# EAGLE design aiie (EAGLE 9.6.2)
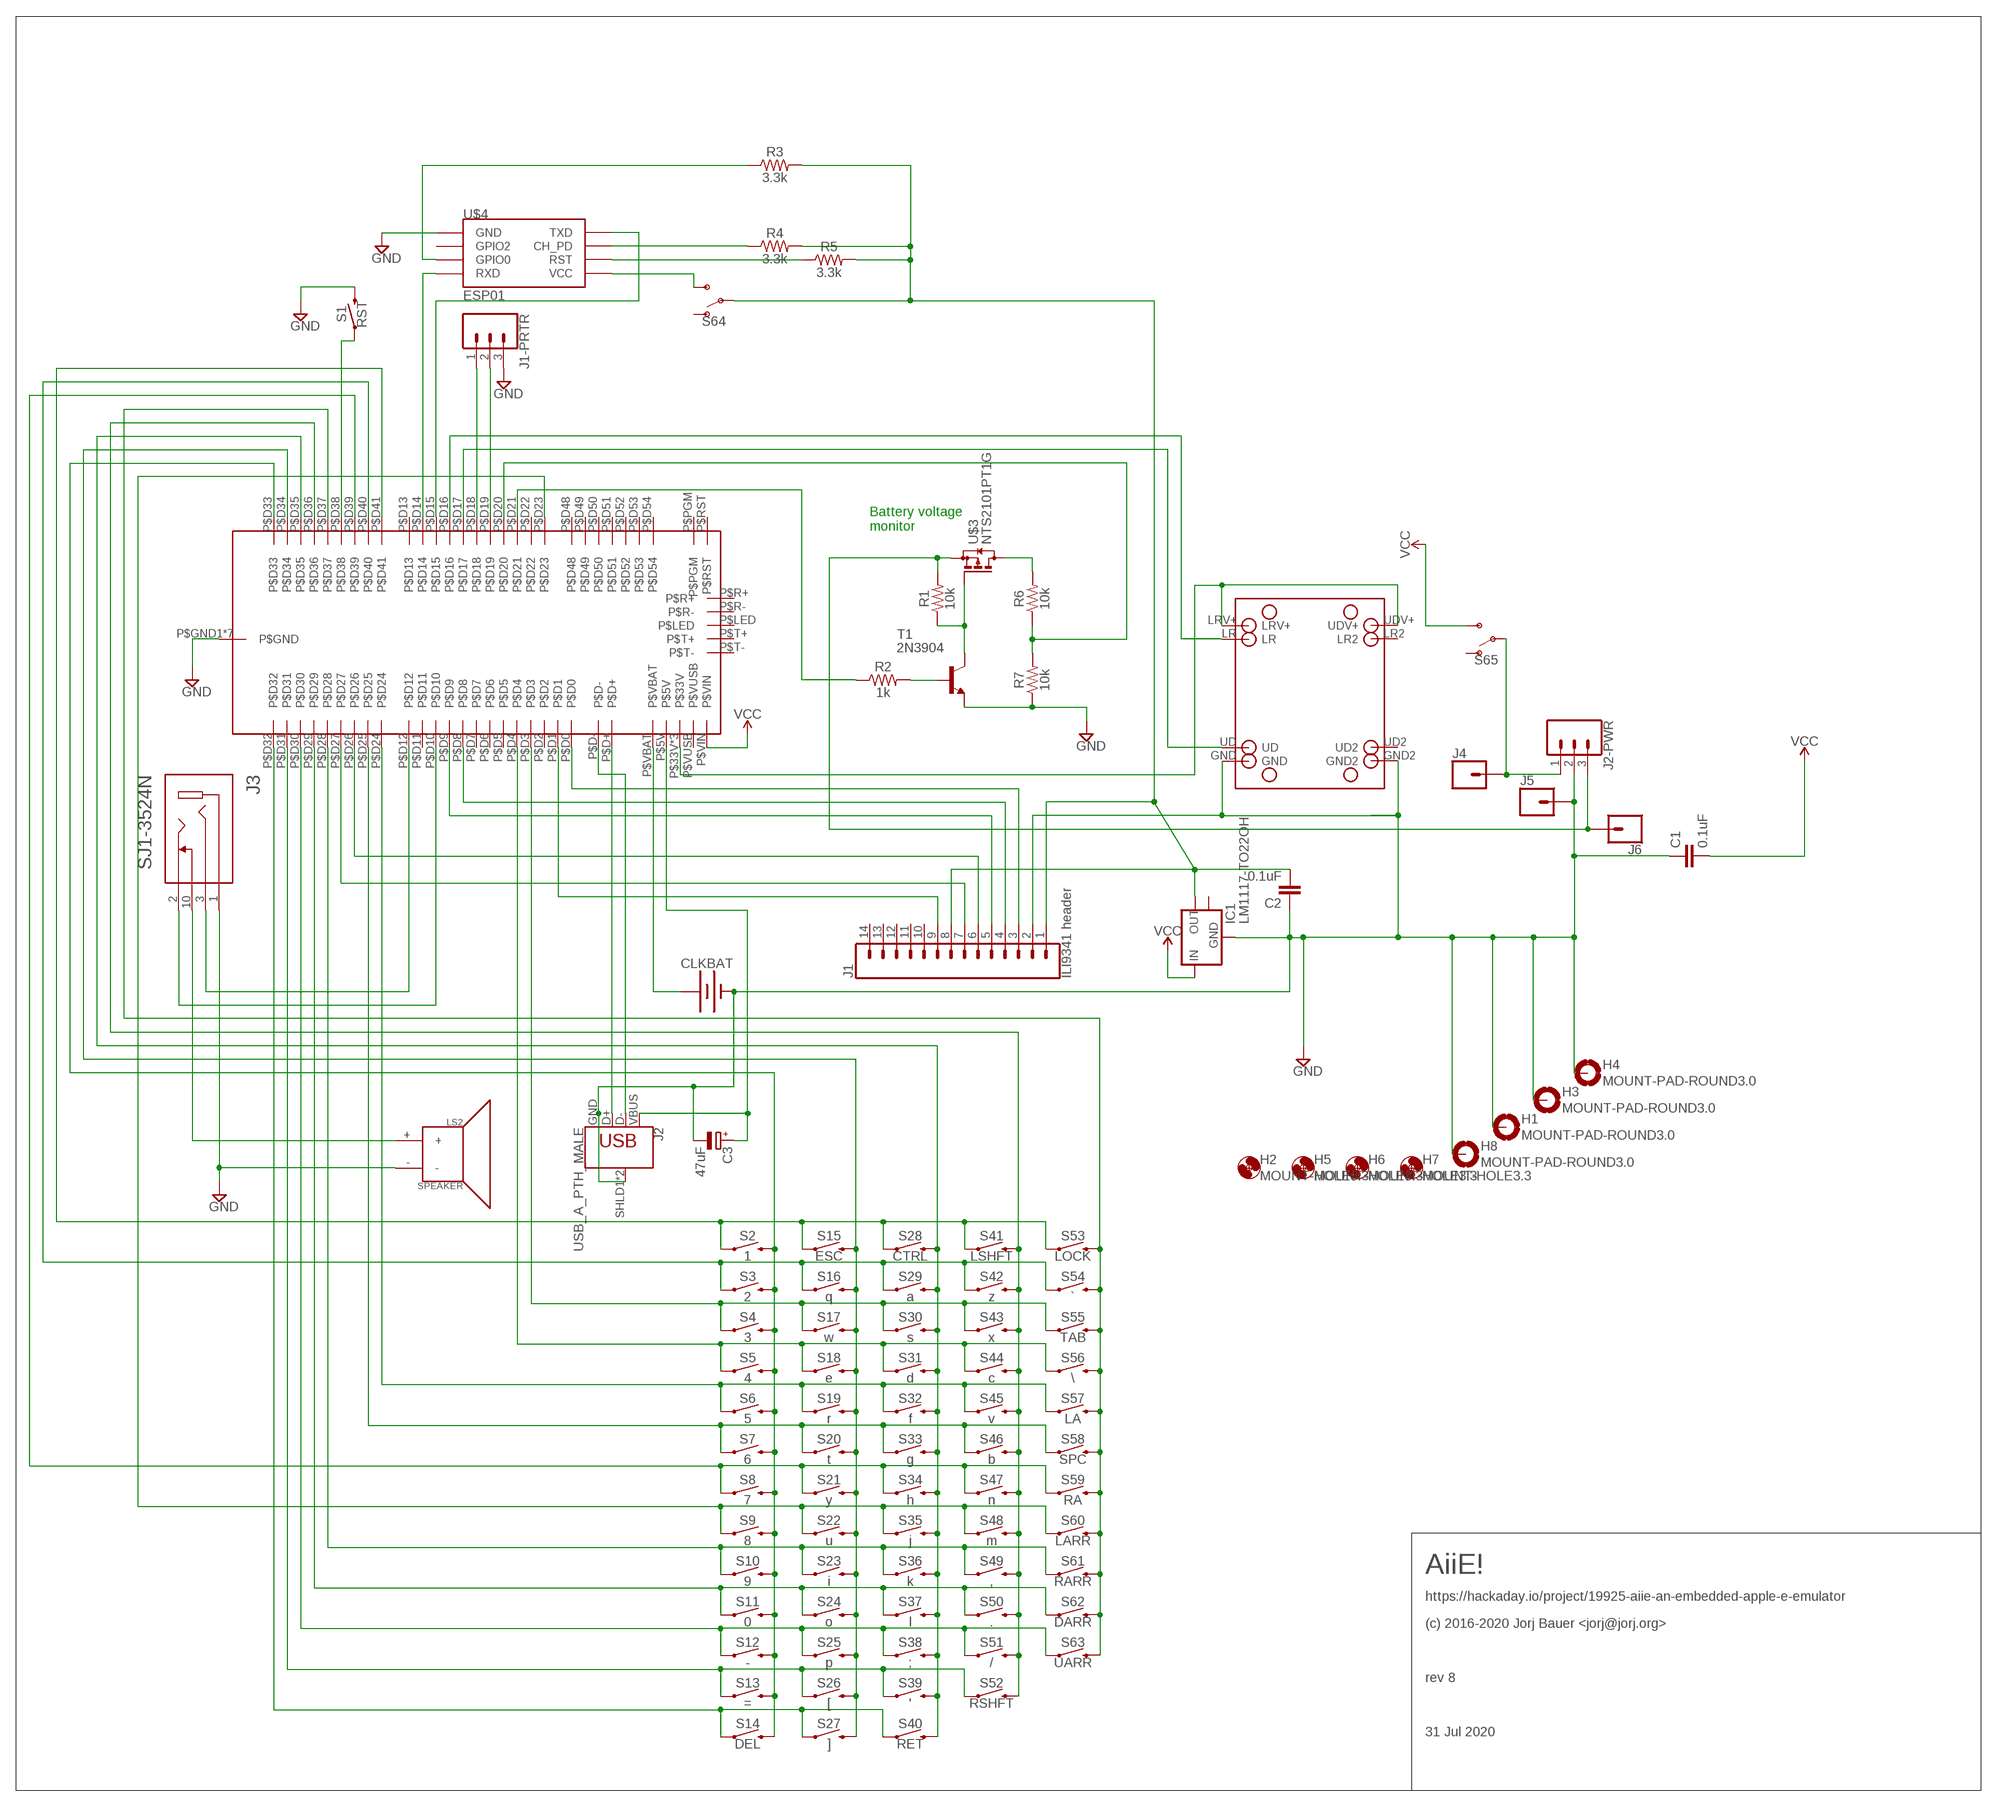
[diagram p0: schematic, sheet 1]

## Parts
C1  0.1uF  C-EU025_050-025X075  [C025_050-025X075]
C2  0.1uF  C-EU025_050-025X075  [C025_050-025X075]
C3  47uF  C-POL_RADIAL-11MM-DIA  [CAPPRD508W65D1000H1100B]
CLKBAT  BATTERY-20MM_PTH  [BATTCOM_20MM_PTH]
H1  MOUNT-PAD-ROUND3.0  [3,0-PAD]
H2  MOUNT-HOLE3.3  [3,3]
H3  MOUNT-PAD-ROUND3.0  [3,0-PAD]
H4  MOUNT-PAD-ROUND3.0  [3,0-PAD]
H5  MOUNT-HOLE3.3  [3,3]
H6  MOUNT-HOLE3.3  [3,3]
H7  MOUNT-HOLE3.3  [3,3]
H8  MOUNT-PAD-ROUND3.0  [3,0-PAD]
IC1  LM1117-TO22OH  [TO220L1]
J1  ILI9341 header  CONN_14  [1X14]
J1-PRTR  CONN_03  [1X03]
J2  USB_A_PTH_MALE  [USB-A-H]
J2-PWR  CONN_03  [1X03]
J3  SJ1-3524N  [CUI_SJ1-3524N]
J4  CONN_01  [1X01]
J5  CONN_01  [1X01]
J6  CONN_01  [1X01]
LS2  SPEAKER  [PCB_MOUNT_SPEAKER]
R1  10k  1KOHM-HORIZ-1/4W-1%  [AXIAL-0.3]
R2  1k  1KOHM-HORIZ-1/4W-1%  [AXIAL-0.3]
R3  3.3k  1KOHM-HORIZ-1/4W-1%  [AXIAL-0.3]
R4  3.3k  1KOHM-HORIZ-1/4W-1%  [AXIAL-0.3]
R5  3.3k  1KOHM-HORIZ-1/4W-1%  [AXIAL-0.3]
R6  10k  1KOHM-HORIZ-1/4W-1%  [AXIAL-0.3]
R7  10k  1KOHM-HORIZ-1/4W-1%  [AXIAL-0.3]
S1  RST  MOMENTARY-SWITCH-SPST-PTH-6.0MM  [TACTILE_SWITCH_PTH_6.0MM]
S2  1  MOMENTARY-SWITCH-SPST-PTH-6.0MM  [TACTILE_SWITCH_PTH_6.0MM]
S3  2  MOMENTARY-SWITCH-SPST-PTH-6.0MM  [TACTILE_SWITCH_PTH_6.0MM]
S4  3  MOMENTARY-SWITCH-SPST-PTH-6.0MM  [TACTILE_SWITCH_PTH_6.0MM]
S5  4  MOMENTARY-SWITCH-SPST-PTH-6.0MM  [TACTILE_SWITCH_PTH_6.0MM]
S6  5  MOMENTARY-SWITCH-SPST-PTH-6.0MM  [TACTILE_SWITCH_PTH_6.0MM]
S7  6  MOMENTARY-SWITCH-SPST-PTH-6.0MM  [TACTILE_SWITCH_PTH_6.0MM]
S8  7  MOMENTARY-SWITCH-SPST-PTH-6.0MM  [TACTILE_SWITCH_PTH_6.0MM]
S9  8  MOMENTARY-SWITCH-SPST-PTH-6.0MM  [TACTILE_SWITCH_PTH_6.0MM]
S10  9  MOMENTARY-SWITCH-SPST-PTH-6.0MM  [TACTILE_SWITCH_PTH_6.0MM]
S11  0  MOMENTARY-SWITCH-SPST-PTH-6.0MM  [TACTILE_SWITCH_PTH_6.0MM]
S12  -  MOMENTARY-SWITCH-SPST-PTH-6.0MM  [TACTILE_SWITCH_PTH_6.0MM]
S13  =  MOMENTARY-SWITCH-SPST-PTH-6.0MM  [TACTILE_SWITCH_PTH_6.0MM]
S14  DEL  MOMENTARY-SWITCH-SPST-PTH-6.0MM  [TACTILE_SWITCH_PTH_6.0MM]
S15  ESC  MOMENTARY-SWITCH-SPST-PTH-6.0MM  [TACTILE_SWITCH_PTH_6.0MM]
S16  q  MOMENTARY-SWITCH-SPST-PTH-6.0MM  [TACTILE_SWITCH_PTH_6.0MM]
S17  w  MOMENTARY-SWITCH-SPST-PTH-6.0MM  [TACTILE_SWITCH_PTH_6.0MM]
S18  e  MOMENTARY-SWITCH-SPST-PTH-6.0MM  [TACTILE_SWITCH_PTH_6.0MM]
S19  r  MOMENTARY-SWITCH-SPST-PTH-6.0MM  [TACTILE_SWITCH_PTH_6.0MM]
S20  t  MOMENTARY-SWITCH-SPST-PTH-6.0MM  [TACTILE_SWITCH_PTH_6.0MM]
S21  y  MOMENTARY-SWITCH-SPST-PTH-6.0MM  [TACTILE_SWITCH_PTH_6.0MM]
S22  u  MOMENTARY-SWITCH-SPST-PTH-6.0MM  [TACTILE_SWITCH_PTH_6.0MM]
S23  i  MOMENTARY-SWITCH-SPST-PTH-6.0MM  [TACTILE_SWITCH_PTH_6.0MM]
S24  o  MOMENTARY-SWITCH-SPST-PTH-6.0MM  [TACTILE_SWITCH_PTH_6.0MM]
S25  p  MOMENTARY-SWITCH-SPST-PTH-6.0MM  [TACTILE_SWITCH_PTH_6.0MM]
S26  [  MOMENTARY-SWITCH-SPST-PTH-6.0MM  [TACTILE_SWITCH_PTH_6.0MM]
S27  ]  MOMENTARY-SWITCH-SPST-PTH-6.0MM  [TACTILE_SWITCH_PTH_6.0MM]
S28  CTRL  MOMENTARY-SWITCH-SPST-PTH-6.0MM  [TACTILE_SWITCH_PTH_6.0MM]
S29  a  MOMENTARY-SWITCH-SPST-PTH-6.0MM  [TACTILE_SWITCH_PTH_6.0MM]
S30  s  MOMENTARY-SWITCH-SPST-PTH-6.0MM  [TACTILE_SWITCH_PTH_6.0MM]
S31  d  MOMENTARY-SWITCH-SPST-PTH-6.0MM  [TACTILE_SWITCH_PTH_6.0MM]
S32  f  MOMENTARY-SWITCH-SPST-PTH-6.0MM  [TACTILE_SWITCH_PTH_6.0MM]
S33  g  MOMENTARY-SWITCH-SPST-PTH-6.0MM  [TACTILE_SWITCH_PTH_6.0MM]
S34  h  MOMENTARY-SWITCH-SPST-PTH-6.0MM  [TACTILE_SWITCH_PTH_6.0MM]
S35  j  MOMENTARY-SWITCH-SPST-PTH-6.0MM  [TACTILE_SWITCH_PTH_6.0MM]
S36  k  MOMENTARY-SWITCH-SPST-PTH-6.0MM  [TACTILE_SWITCH_PTH_6.0MM]
S37  l  MOMENTARY-SWITCH-SPST-PTH-6.0MM  [TACTILE_SWITCH_PTH_6.0MM]
S38  ;  MOMENTARY-SWITCH-SPST-PTH-6.0MM  [TACTILE_SWITCH_PTH_6.0MM]
S39  '  MOMENTARY-SWITCH-SPST-PTH-6.0MM  [TACTILE_SWITCH_PTH_6.0MM]
S40  RET  MOMENTARY-SWITCH-SPST-PTH-6.0MM  [TACTILE_SWITCH_PTH_6.0MM]
S41  LSHFT  MOMENTARY-SWITCH-SPST-PTH-6.0MM  [TACTILE_SWITCH_PTH_6.0MM]
S42  z  MOMENTARY-SWITCH-SPST-PTH-6.0MM  [TACTILE_SWITCH_PTH_6.0MM]
S43  x  MOMENTARY-SWITCH-SPST-PTH-6.0MM  [TACTILE_SWITCH_PTH_6.0MM]
S44  c  MOMENTARY-SWITCH-SPST-PTH-6.0MM  [TACTILE_SWITCH_PTH_6.0MM]
S45  v  MOMENTARY-SWITCH-SPST-PTH-6.0MM  [TACTILE_SWITCH_PTH_6.0MM]
S46  b  MOMENTARY-SWITCH-SPST-PTH-6.0MM  [TACTILE_SWITCH_PTH_6.0MM]
S47  n  MOMENTARY-SWITCH-SPST-PTH-6.0MM  [TACTILE_SWITCH_PTH_6.0MM]
S48  m  MOMENTARY-SWITCH-SPST-PTH-6.0MM  [TACTILE_SWITCH_PTH_6.0MM]
S49  ,  MOMENTARY-SWITCH-SPST-PTH-6.0MM  [TACTILE_SWITCH_PTH_6.0MM]
S50  .  MOMENTARY-SWITCH-SPST-PTH-6.0MM  [TACTILE_SWITCH_PTH_6.0MM]
S51  /  MOMENTARY-SWITCH-SPST-PTH-6.0MM  [TACTILE_SWITCH_PTH_6.0MM]
S52  RSHFT  MOMENTARY-SWITCH-SPST-PTH-6.0MM  [TACTILE_SWITCH_PTH_6.0MM]
S53  LOCK  MOMENTARY-SWITCH-SPST-PTH-6.0MM  [TACTILE_SWITCH_PTH_6.0MM]
S54  `  MOMENTARY-SWITCH-SPST-PTH-6.0MM  [TACTILE_SWITCH_PTH_6.0MM]
S55  TAB  MOMENTARY-SWITCH-SPST-PTH-6.0MM  [TACTILE_SWITCH_PTH_6.0MM]
S56  \\  MOMENTARY-SWITCH-SPST-PTH-6.0MM  [TACTILE_SWITCH_PTH_6.0MM]
S57  LA  MOMENTARY-SWITCH-SPST-PTH-6.0MM  [TACTILE_SWITCH_PTH_6.0MM]
S58  SPC  MOMENTARY-SWITCH-SPST-PTH-6.0MM  [TACTILE_SWITCH_PTH_6.0MM]
S59  RA  MOMENTARY-SWITCH-SPST-PTH-6.0MM  [TACTILE_SWITCH_PTH_6.0MM]
S60  LARR  MOMENTARY-SWITCH-SPST-PTH-6.0MM  [TACTILE_SWITCH_PTH_6.0MM]
S61  RARR  MOMENTARY-SWITCH-SPST-PTH-6.0MM  [TACTILE_SWITCH_PTH_6.0MM]
S62  DARR  MOMENTARY-SWITCH-SPST-PTH-6.0MM  [TACTILE_SWITCH_PTH_6.0MM]
S63  UARR  MOMENTARY-SWITCH-SPST-PTH-6.0MM  [TACTILE_SWITCH_PTH_6.0MM]
S64  SWITCH-SPDT-PTH-11.6X4.0MM  [SWITCH_SPDT_PTH_11.6X4.0MM]
S65  SWITCH-SPDT-PTH-11.6X4.0MM  [SWITCH_SPDT_PTH_11.6X4.0MM]
T1  2N3904  [TO92]
U$1  PARALLAX2AXIS  [PARALLAX2AXIS]
U$2  TEENSY41  [TEENSY41]
U$3  NTS2101PT1G  [SOT323]
U$4  ESP01  [ESP01]

## Nets
GND [ground]: C1.1 C2.1 C3.2(-) CLKBAT.2(-) H1.B3,0(MOUNT) H3.B3,0(MOUNT) H4.B3,0(MOUNT) H8.B3,0(MOUNT) IC1.1(GND) J1-PRTR.3 J1.2 J2-PWR.2 J2.GND J2.SHLD1(SHIELD) J2.SHLD2(SHIELD) J3.1 J5.1 LS2.- R7.P$1 S1.3 T1.3(E) U$1.GND U$1.GND2 U$2.P$GND1(P$GND) U$2.P$GND2(P$GND) U$2.P$GND3(P$GND) U$2.P$GND4(P$GND) U$2.P$GND5(P$GND) U$2.P$GND6(P$GND) U$2.P$GND7(P$GND) U$4.GND
N$1: CLKBAT.1(+) U$2.P$VBAT
N$2: S2.3 S3.3 S4.3 S5.3 S6.3 S7.3 S8.3 S9.3 S10.3 S11.3 S12.3 S13.3 S14.3 U$2.P$D33
N$3: S15.3 S16.3 S17.3 S18.3 S19.3 S20.3 S21.3 S22.3 S23.3 S24.3 S25.3 S26.3 S27.3 U$2.P$D34
N$4: S28.3 S29.3 S30.3 S31.3 S32.3 S33.3 S34.3 S35.3 S36.3 S37.3 S38.3 S39.3 S40.3 U$2.P$D35
N$5: S41.3 S42.3 S43.3 S44.3 S45.3 S46.3 S47.3 S48.3 S49.3 S50.3 S51.3 S52.3 U$2.P$D36
N$6: S53.3 S54.3 S55.3 S56.3 S57.3 S58.3 S59.3 S60.3 S61.3 S62.3 S63.3 U$2.P$D37
N$7: S2.1 S15.1 S28.1 S41.1 S53.1 U$2.P$D41
N$8: S4.1 S17.1 S30.1 S43.1 S55.1 U$2.P$D3
N$9: S3.1 S16.1 S29.1 S42.1 S54.1 U$2.P$D40
N$10: S1.1 U$2.P$D38
N$11: S5.1 S18.1 S31.1 S44.1 S56.1 U$2.P$D4
N$12: J2.D- U$2.P$D-
N$13: S6.1 S19.1 S32.1 S45.1 S57.1 U$2.P$D24
N$14: C2.2 IC1.2(VOUT) J1.1 J1.8 R3.P$2 R4.P$2 R5.P$2 S64.2(P)
N$15: S7.1 S20.1 S33.1 S46.1 S58.1 U$2.P$D25
N$16: J1.3 U$2.P$D0
N$17: S8.1 S21.1 S34.1 S47.1 S59.1 U$2.P$D39
N$18: J1.4 U$2.P$D8
N$19: S9.1 S22.1 S35.1 S48.1 S60.1 U$2.P$D23
N$20: J1.5 U$2.P$D9
N$21: S10.1 S23.1 S36.1 S49.1 S61.1 U$2.P$D28
N$22: J1.6 U$2.P$D26
N$23: S11.1 S24.1 S37.1 S50.1 S62.1 U$2.P$D29
N$24: J1.7 U$2.P$D27
N$25: S12.1 S25.1 S38.1 S51.1 S63.1 U$2.P$D30
N$26: S13.1 S26.1 S39.1 S52.1 U$2.P$D31
N$27: S14.1 S27.1 S40.1 U$2.P$D32
N$28: J1.9 U$2.P$D1
N$29: U$1.UD U$2.P$D17
N$30: J2.D+ U$2.P$D+
N$31: J3.2 U$2.P$D10
N$32: S64.3(S) U$4.VCC
N$33: J3.3 U$2.P$D12
N$34: R3.P$1 U$4.GPIO0
N$35: R4.P$1 U$4.CH_PD
N$36: R5.P$1 U$4.RST
N$37: U$2.P$D14 U$4.RX(RXD)
N$38: U$2.P$D15 U$4.TX(TXD)
N$39: J3.10 LS2.+
N$40: J2-PWR.3 J6.1 R1.P$2 U$3.2(S)
N$41: R1.P$1 T1.1(C) U$3.1(G)
N$42: U$1.LR U$2.P$D16
N$43: J1-PRTR.1 U$2.P$D18
N$44: J1-PRTR.2 U$2.P$D19
N$45: R2.P$2 T1.2(B)
N$46: J2-PWR.1 J4.1 S65.2(P)
N$47: U$1.LRV+ U$1.UDV+ U$2.P$33V U$2.P$33V2(P$33V) U$2.P$33V3(P$33V)
N$48: R6.P$1 R7.P$2 U$2.P$D20
N$49: R6.P$2 U$3.3(D)
N$50: R2.P$1 U$2.P$D21
N$51 [vcc]: C3.1(+) J2.VBUS U$2.P$5V
VCC [vcc]: C1.2 IC1.3(VIN) S65.3(S) U$2.P$VIN
Unconnected: IC1.4(HEATSINK) J1.10 J1.11 J1.12 J1.13 J1.14 S64.1(O) S65.1(O) U$1.LR2 U$1.UD2 U$2.P$D2 U$2.P$D5 U$2.P$D6 U$2.P$D7 U$2.P$D11 U$2.P$D13 U$2.P$D22 U$2.P$D48 U$2.P$D49 U$2.P$D50 U$2.P$D51 U$2.P$D52 U$2.P$D53 U$2.P$D54 U$2.P$LED U$2.P$PGM U$2.P$R+ U$2.P$R- U$2.P$RST U$2.P$T+ U$2.P$T- U$2.P$VUSB U$4.GPIO2

## Notes on the sheet
- Battery voltage
  monitor
- AiiE!
- https://hackaday.io/project/19925-aiie-an-embedded-apple-e-emulator
- (c) 2016-2020 Jorj Bauer <jorj@jorj.org>
- rev 8
- 31 Jul 2020

## Library data of the parts
C1 C2 = rcl:C-EU: CAPACITOR, European symbol
C3 = Capacitor:C-POL: Capacitor Polarised - Generic; CATEGORY: Capacitor
CLKBAT = SparkFun-Batteries:BATTERY: Battery - Single Cell A variety of battery chemistries, sizes, and footprints. Device List: 20MM_PTH - Coin Cell Battery Holder - 20mm (PTH) <https://www.sparkfun.com/products/783> 12MM_SMD - Coin Cell Battery Holder - 12mm (SMD) <https://www.sparkfun.com/products/10592> 12MM_PTH - Coin Cell Battery Holder - 12mm (PTH) <https://www.sparkfun.com/products/7948> 20MM_SMD - 20mm Coin Cell Battery Holder (SMD) (2 legs) Used on the Big Time Watch Kit <https://www.sparkfun.com/products/11734> 20MM_SMD_4LEGS - Coin Cell Battery Holder - 20mm (SMD) <https://www.sparkfun.com/products/11892> 20MM_SMD_4LEGS_OVERPASTE - Coin Cell Battery Holder - 20mm (SMD) <https://www.sparkfun.com/products/11892> (Over-paste on the legs) 24.5MM_PTH - Coin Cell Battery Holder - 24.5mm (PTH) <https://www.sparkfun.com/products/8863> 9V - 9V Battery Holder - PC Mount Used on the SparkFun SparkPunk Sound Kit <https://www.sparkfun.com/products/11177> and SparkFun SparkPunk Sequencer Kit <https://www.sparkfun.com/products/12707> 18650 - Battery Holder - 18650 (PTH) <https://www.sparkfun.com/products/13113> AA - Battery Holder - 1xAA (PTH) <https://www.sparkfun.com/products/7949> AAA - Battery Holder - 1xAAA (PTH) <https://www.sparkfun.com/products/12718> AA_KIT - Battery Holder - 1xAA (PTH) <https://www.sparkfun.com/products/7949> Special kit package - pads only have exposed copper on one side of the board. AAA_KIT - Battery Holder - 1xAAA (PTH) <https://www.sparkfun.com/products/12718> Special kit package - pads only have exposed copper on one side of the board.; PROD_ID: BATT-09031; SF_SKU: PRT-00783
H1 H3 H4 H8 = holes:MOUNT-PAD-ROUND: MOUNTING PAD, round
H2 H5-H7 = holes:MOUNT-HOLE: MOUNTING HOLE with drill center marker
IC1 = bt_regulator:LM1117: LDO Voltage Regulator NCP1117 series are low dropout positive voltage regulators that are capable of providing an output current that is in excess of 1.0 A with a maximum dropout voltage of 1.2 V at 800 mA over temperature. This series contains nine fixed output voltages of 1.5 V, 1.8 V, 1.9 V, 2.0 V, 2.5 V, 2.85 V, 3.3 V, 5.0 V, and 12 V that have no minimum load requirement to maintain regulation. Also included is an adjustable output version that can be programmed from 1.25 V to 18.8 V with two external resistors. datasheet.pdf <http://www.onsemi.com/pub_link/Collateral/NCP1117-D.PDF> LM1117-N is a series of low dropout voltage regulators of 1.2V at 800mA of load current. It has the same pin-out as Texas Instruments' industry standard LM317. The LM1117-N is available in an adjustable version, available in five fixed voltages, 1.8V, 2.5V, 2.85V, 3.3V, and 5V. The LM1117-N offers current limiting and thermal shutdown. Its circuit includes a zener trimmed to within ±1%. datasheet.pdf <http://www.ti.com/lit/ds/symlink/lm1117-n.pdf>
J1 = SparkFun-Connectors:CONN_14: Multi connection point. Often used as Generic Header-pin footprint for 0.1 inch spaced/style header connections On any of the 0.1 inch spaced packages, you can populate with these: Break Away Headers - Straight <https://www.sparkfun.com/products/116> (PRT-00116) Break Away Male Headers - Right Angle <https://www.sparkfun.com/products/553> (PRT-00553) Female Headers <https://www.sparkfun.com/products/115> (PRT-00115) Break Away Headers - Machine Pin <https://www.sparkfun.com/products/117> (PRT-00117) Break Away Female Headers - Swiss Machine Pin <https://www.sparkfun.com/products/743> (PRT-00743) For SCREWTERMINALS and SPRING TERMINALS visit here: Screw Terimnals on SparkFun.com <https://www.sparkfun.com/search/results?term=Screw+Terminals> (5mm/3.5mm/2.54mm spacing) This device is also useful as a general connection point to wire up your design to another part of your project. Our various solder wires solder well into these plated through hole pads. Hook-Up Wire - Assortment (Stranded, 22 AWG) <https://www.sparkfun.com/products/11375> (PRT-11375) Hook-Up Wire - Assortment (Solid Core, 22 AWG) <https://www.sparkfun.com/products/11367> (PRT-11367) View the entire wire category on our website here <https://www.sparkfun.com/categories/141> Special notes: Molex polarized connector foot print use with SKU : PRT-08231 with associated crimp pins and housings. 1MM SMD Version SKU: PRT-10208 NOTES ON THE VARIANTS LOCK and LOCK_LONGPADS... This footprint was designed to help hold the alignment of a through-hole component (i.e. 6-pin header) while soldering it into place. You may notice that each hole has been shifted either up or down by 0.005 of an inch from it's more standard position (which is a perfectly straight line). This slight alteration caused the pins (the squares in the middle) to touch the edges of the holes. Because they are alternating, it causes a "brace" to hold the component in place. 0.005 has proven to be the perfect amount of "off-center" position when using our standard breakaway headers. Although looks a little odd when you look at the bare footprint, once you have a header in there, the alteration is very hard to notice. Also,if you push a header all the way into place, it is covered up entirely on the bottom side.
J1-PRTR J2-PWR = SparkFun-Connectors:CONN_03: Multi connection point. Often used as Generic Header-pin footprint for 0.1 inch spaced/style header connections On any of the 0.1 inch spaced packages, you can populate with these: Break Away Headers - Straight <https://www.sparkfun.com/products/116> (PRT-00116) Break Away Male Headers - Right Angle <https://www.sparkfun.com/products/553> (PRT-00553) Female Headers <https://www.sparkfun.com/products/115> (PRT-00115) Break Away Headers - Machine Pin <https://www.sparkfun.com/products/117> (PRT-00117) Break Away Female Headers - Swiss Machine Pin <https://www.sparkfun.com/products/743> (PRT-00743) Stackable Header - 3 Pin (Female, 0.1") <https://www.sparkfun.com/products/13875> (PRT-13875) For SCREWTERMINALS and SPRING TERMINALS visit here: Screw Terimnals on SparkFun.com <https://www.sparkfun.com/search/results?term=Screw+Terminals> (5mm/3.5mm/2.54mm spacing) This device is also useful as a general connection point to wire up your design to another part of your project. Our various solder wires solder well into these plated through hole pads. Hook-Up Wire - Assortment (Stranded, 22 AWG) <https://www.sparkfun.com/products/11375> (PRT-11375) Hook-Up Wire - Assortment (Solid Core, 22 AWG) <https://www.sparkfun.com/products/11367> (PRT-11367) View the entire wire category on our website here <https://www.sparkfun.com/categories/141> Special notes: Molex polarized connector foot print use with SKU : PRT-08232 with associated crimp pins and housings.
J2 = SparkFun-Connectors:USB_A: USB-A Connector Male and female variants, as well as PTH and SMT variants SparkFun Products: SparkFun XBee Explorer Dongle <https://www.sparkfun.com/products/11697> PTH Male SparkFun MicroView-USB Programmer <https://www.sparkfun.com/products/12924> SMT Male SparkFun USB Type A Female Breakout <https://www.sparkfun.com/products/12700> SMT Female; PROD_ID: CONN-08367; SF_ID: PRT-00437
J3 = SJ1-3524N:SJ1-3524N: 3.5 mm Right-Angle Stereo Jack, 4 Pin PCB Mount, Non-Threaded; ARROW_ELECTRONICS-PURCHASE-URL: https://snapeda.com/shop?store=Arrow+Electronics&id=596196; CUI_PURCHASE_URL: https://www.cuidevices.com/product/interconnect/connectors/audio-connectors/jacks/sj1-352xn-series?utm_source=snapeda.com&utm_medium=referral&utm_campaign=snapedaBOM; DESCRIPTION: 3.5 mm, Stereo, Right Angle, Through Hole, Audio Jack Connector; DIGI-KEY_PART_NUMBER: CP1-3524NG-ND; DIGIKEY-PURCHASE-URL: https://snapeda.com/shop?store=DigiKey&id=596196; MF: CUI Devices; MOUSER-PURCHASE-URL: https://snapeda.com/shop?store=Mouser&id=596196; MP: SJ1-3524N; PACKAGE: None
J4-J6 = SparkFun-Connectors:CONN_01: Single connection point. Often used as Generic Header-pin footprint for 0.1 inch spaced/style header connections On any of the 0.1 inch spaced packages, you can populate with these: Break Away Headers - Straight <https://www.sparkfun.com/products/116> (PRT-00116) Break Away Male Headers - Right Angle <https://www.sparkfun.com/products/553> (PRT-00553) Female Headers <https://www.sparkfun.com/products/115> (PRT-00115) Break Away Headers - Machine Pin <https://www.sparkfun.com/products/117> (PRT-00117) Break Away Female Headers - Swiss Machine Pin <https://www.sparkfun.com/products/743> (PRT-00743) This device is also useful as a general connection point to wire up your design to another part of your project. Our various solder wires solder well into these plated through hole pads. Hook-Up Wire - Assortment (Stranded, 22 AWG) <https://www.sparkfun.com/products/11375> (PRT-11375) Hook-Up Wire - Assortment (Solid Core, 22 AWG) <https://www.sparkfun.com/products/11367> (PRT-11367) View the entire wire category on our website here <https://www.sparkfun.com/categories/141> Special notes: SMTSO-256-ET is a "flush mount" nut for a 4-40 screw. We mostly use this on specialty testbeds; it is a nice way to connect hardware to your PCB at an adjustable hieght. Also note, the SNAP packages are for using a snappable style connector. We sell a baggie of snaps and they are also used on two LilyPad designs: Snap Assortment - 30 pack (male and female) <https://www.sparkfun.com/products/11347> (DEV-11347) LilyPad Arduino SimpleSnap <https://www.sparkfun.com/products/10941> (DEV-10941) LilyPad SimpleSnap Protoboard <https://www.sparkfun.com/products/10940> (DEV-10940)
LS2 = SparkFun-Electromechanical:SPEAKER: Speaker Generic 2-terminal loudspeakers SparkFun Products Speaker - PCB Mount <https://www.sparkfun.com/products/11089> (COM-11089); PROD_ID: COMP-11789; SF_SKU: COM-11089
R1 R3-R7 = SparkFun-Resistors:1KOHM: 1kΩ resistor A resistor is a passive two-terminal electrical component that implements electrical resistance as a circuit element. Resistors act to reduce current flow, and, at the same time, act to lower voltage levels within circuits. - Wikipedia; PROD_ID: RES-12182; VALUE: 1k
R2 = SparkFun-Resistors:1KOHM: 1kΩ resistor A resistor is a passive two-terminal electrical component that implements electrical resistance as a circuit element. Resistors act to reduce current flow, and, at the same time, act to lower voltage levels within circuits. - Wikipedia; PROD_ID: RES-12182
S1-S63 = SparkFun-Switches:MOMENTARY-SWITCH-SPST: Momentary Switch (Pushbutton) - SPST Normally-open (NO) SPST momentary switches (buttons, pushbuttons). Variants PTH-12MM - 12mm square, through-hole Momentary Pushbutton Switch - 12mm Square <https://www.sparkfun.com/products/9190> (COM-09190) PTH-6.0MM, PTH-6.0MM-KIT - 6.0mm square, through-hole Mini Pushbutton Switch <https://www.sparkfun.com/products/97> (COM-00097) KIT package intended for soldering kit's - only one side of pads' copper is exposed. PTH-RIGHT-ANGLE-KIT - Right-angle, through-hole Right Angle Tactile Button <https://www.sparkfun.com/products/10791> - Used on SparkFun BigTime Watch Kit <https://www.sparkfun.com/products/11734> SMD-12MM - 12mm square, surface-mount Tactile Button - SMD (12mm) <https://www.sparkfun.com/products/12993> (COM-12993) Used on SparkFun PicoBoard <https://www.sparkfun.com/products/11888> SMD-4.5MM - 4.5mm Square Trackball Switch Used on SparkFun Blackberry Trackballer Breakout <https://www.sparkfun.com/products/13169> SMD-4.6MMX2.8MM - 4.60mm x 2.80mm, surface mount Used on SparkFun SAMD21 Mini Breakout <https://www.sparkfun.com/products/13664> SMD-5.2MM, SMD-5.2-REDUNDANT - 5.2mm square, surface-mount Mini Pushbutton Switch - SMD <https://www.sparkfun.com/products/8720> (COM-08720) Used on Arduino Pro Mini <https://www.sparkfun.com/products/11114> REDUNDANT package connects both switch circuits together SMD-6.0X3.5MM - 6.0 x 3.5mm, surface mount Momentary Reset Switch SMD <https://www.sparkfun.com/products/8229> (COM-08229) SMD-6.2MM-TALL - 6.2mm square, surface mount Tactile Button - SMD (6mm) <https://www.sparkfun.com/products/12992> Used on SparkFun Digital Sandbox <https://www.sparkfun.com/products/12651> SMD-RIGHT-ANGLE - Right-angle, surface mount Used on SparkFun Block for Intel® Edison - Arduino <https://www.sparkfun.com/products/13036>; PROD_ID: SWCH-08441; SF_SKU: COM-00097
S64 S65 = SparkFun-Switches:SWITCH-SPDT: Single Pole, Double Throw (SPDT) Switch Single-pole, double-throw (SPDT) switch. Variant Overview SMD-AYZ0202 Surface Mount DPDT Switch <https://www.sparkfun.com/products/597> (COM-00597) Used on e.g. LilyPad Arduino USB - ATmega32U4 Board <https://www.sparkfun.com/products/12049> PTH-11.6X4.0MM SPDT Mini Power Switch <https://www.sparkfun.com/products/102> (COM-00102) Used on e.g. SparkFun Simon Says - Through-Hole Soldering Kit <https://www.sparkfun.com/products/10547> (KIT-10547) PTH-11.6X4.0MM-KIT KIT version of SPDT Mini Power Switch - Simplifies soldering by removing tStop of switch pins - only one side can be soldered. PTH-11.6X4.0MM-LOCK LOCK version of SPDT Mini Power Switch - Offset pins hold switch in place for easier soldering. SMD-RIGHT-ANGLE Surface Mount Right Angle Switch <https://www.sparkfun.com/products/10860> (COM-10860) Used on e.g. SparkFun ESP8266 Thing <https://www.sparkfun.com/products/13231>; PROD_ID: SWCH-08261; SF_SKU: COM-00102
T1 = transistor:2N3904: NPN TRANSISTOR
U$1 = jorjlib:PARALLAX2AXIS
U$2 = jorjlib:TEENSY41: Teensy 4.1. Pins 48-54 are actually SOIC pads on the bottom of the board; the shown holes are landing spots for pogo pins. (Pogo pin alignment is not verified as of this writing.)
U$3 = NTS2101PT1G:NTS2101PT1G; ARROW_ELECTRONICS-PURCHASE-URL: https://snapeda.com/shop?store=Arrow+Electronics&id=274586; DESCRIPTION: P-Channel 8V 1.4A (Ta) 290mW (Ta) Surface Mount SC-70-3 (SOT323); DIGI-KEY_PART_NUMBER: NTS2101PT1GOSCT-ND; DIGIKEY-PURCHASE-URL: https://snapeda.com/shop?store=DigiKey&id=274586; MF: ON Semiconductor; MOUSER-PURCHASE-URL: https://snapeda.com/shop?store=Mouser&id=274586; MP: NTS2101PT1G; PACKAGE: SOT-323 ON Semiconductor
U$4 = esp8266modules:ESP01: ESP8266 Wifi module 01

## Net classes
0 default: width 0.254 mm, clearance 0.203 mm
1 ground: width 0.356 mm, clearance 0.203 mm
2 vcc: width 0.356 mm, clearance 0.203 mm

## Board
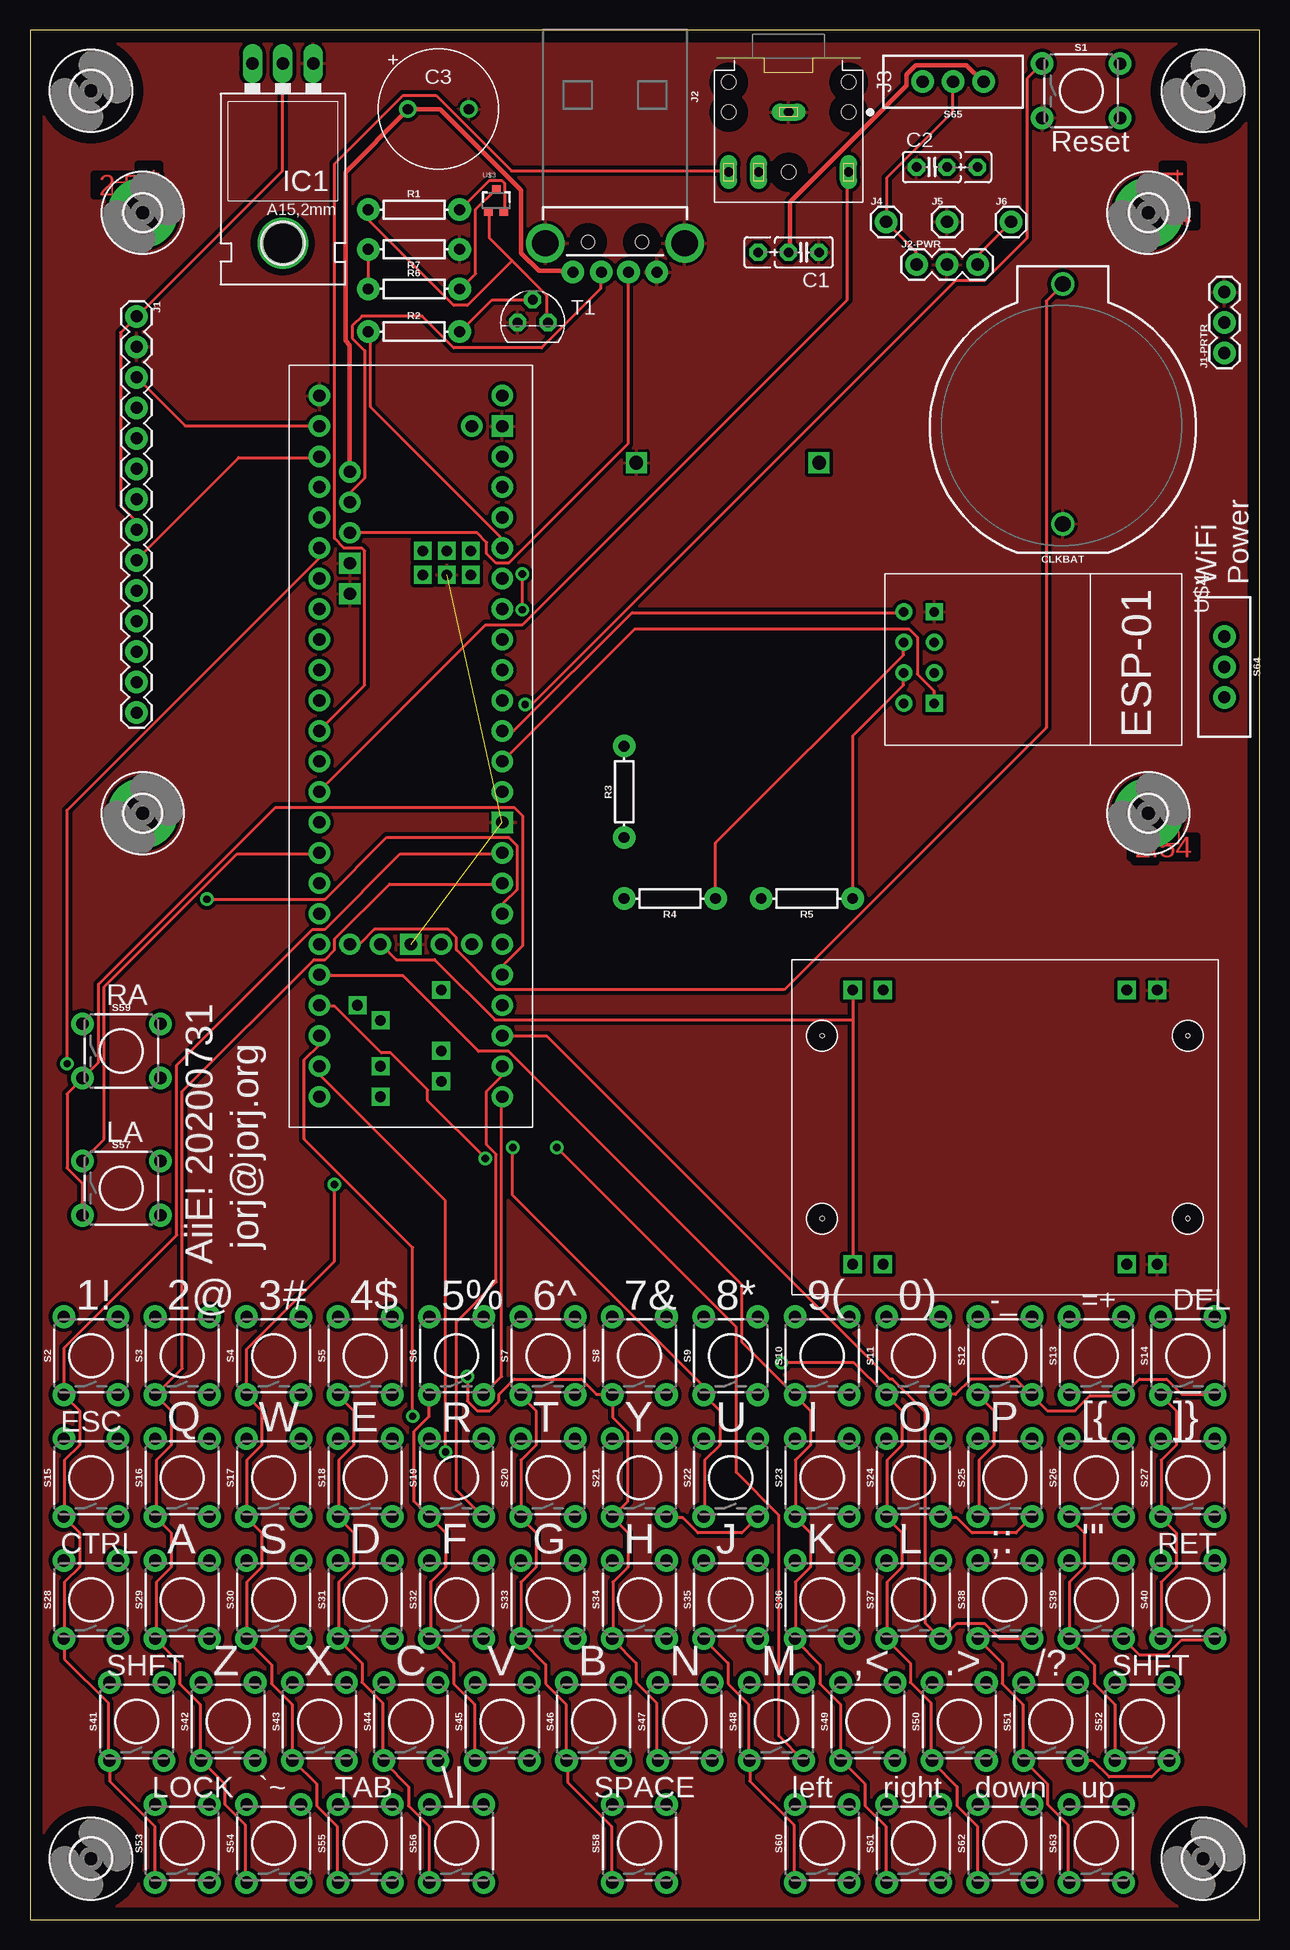
[diagram p1: board, top side]
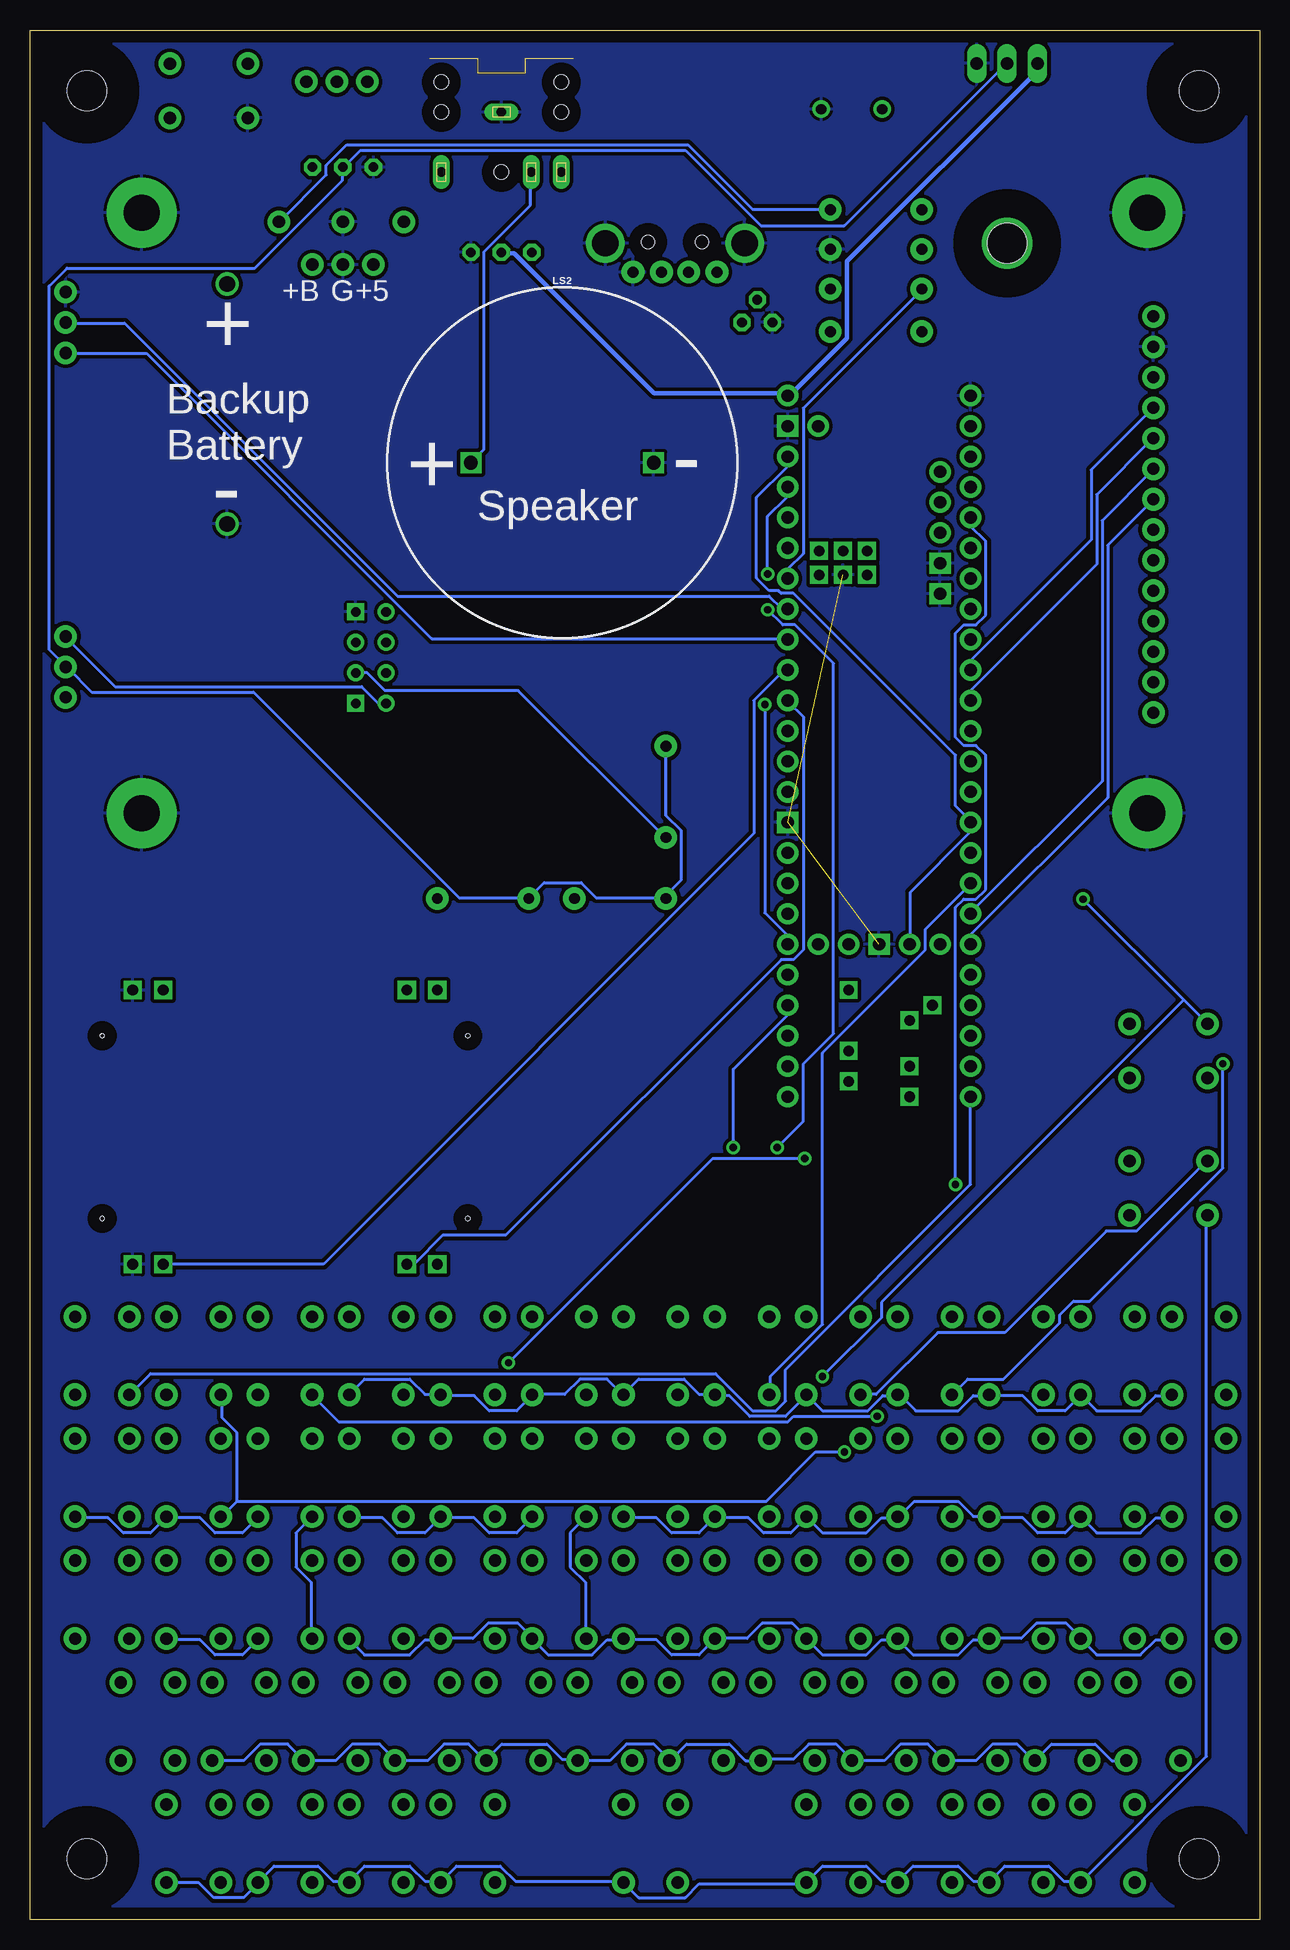
[diagram p2: board, bottom side, seen from below]

Size 102.54 x 157.47 mm. Coordinates in mm from the lower left corner, seen from the top.
Outline: 0,0 102.54,0 102.54,157.47 0,157.47 0,0
Copper layers (1*16): Top 0.035mm / dielectric 1.5mm / Bottom 0.035mm
Design rules "default *": minimum track width 10mil, minimum drill 24mil, track to track 8mil, track to pad 8mil, pad to pad 8mil, via to via 8mil, smd to smd 8mil, copper to edge 40mil, drill to drill 8mil, minimum pad ring 12mil, minimum via ring 10mil, stop-mask expansion 4mil, vias tented up to drill 0mil, thermal gap 10mil

### Footprints (pad centres in the part's own frame; a part is rotated, then mirrored left to right if it is on the bottom)
C025_050-025X075 = drill 0.813 octagon: 1 -1.27,0; 2 1.27,0; 3 3.81,0
CAPPRD508W65D1000H1100B = drill 0.85 pad 1.45: 1 -2.54,0; 2 2.54,0
BATTCOM_20MM_PTH = drill 1.3: 1 11.85,0; 2 -8.15,0
3,0-PAD = drill 3 pad 5.842: B3,0 0,0
3,3 = hole 3.3: 0,0
TO220L1 = drill 1.016 long: 1 -2.54,-3.81; 2 0,-3.81; 3 2.54,-3.81 | drill 3.2: 4 0,11.176 | hole 3.302: 0,11.176
1X14 = drill 1.016 pad 1.88: 1 0,0; 2 2.54,0; 3 5.08,0; 4 7.62,0; 5 10.16,0; 6 12.7,0; 7 15.24,0; 8 17.78,0; 9 20.32,0; 10 22.86,0; 11 25.4,0; 12 27.94,0; 13 30.48,0; 14 33.02,0
1X03 = drill 1.016 pad 1.88: 1 0,0; 2 2.54,0; 3 5.08,0
USB-A-H = drill 0.914 pad 1.88: D+ 2.4,1.127; D- 2.4,-1.127; GND 2.4,3.5; VBUS 2.4,-3.5 | drill 2.2: SHLD1 0,-5.8; SHLD2 0,5.8 | hole 1.1: -0.1,2.25; -0.1,-2.25
CUI_SJ1-3524N = drill 0.8 long: 1 0,0; 2 5,-5; 3 5,5; 10 5,-2.5 | hole 1.2: -2.5,5; 0,5; 5,0; -2.5,-5; 0,-5
1X01 = drill 1.016 pad 1.88: 1 0,0
PCB_MOUNT_SPEAKER = drill 1.143 square: + -7.62,0; - 7.62,0
AXIAL-0.3 = drill 0.9 pad 1.88: P$1 -3.81,0; P$2 3.81,0
TACTILE_SWITCH_PTH_6.0MM = drill 1.016 pad 1.88: 1 -3.251,2.261; 2 3.251,2.261; 3 -3.251,-2.261; 4 3.251,-2.261
SWITCH_SPDT_PTH_11.6X4.0MM = drill 1.016 pad 1.88: 1 0,2.54; 2 0,0; 3 0,-2.54
TO92 = drill 0.813 octagon: 1 1.27,0; 2 0,1.905; 3 -1.27,0
PARALLAX2AXIS = drill 0.9 square: GND 2.54,5.08; GND2 25.4,5.08; LR 2.54,27.94; LR2 25.4,27.94; LRV+ 2.54,30.48; UD 2.54,7.62; UD2 25.4,7.62; UDV+ 25.4,30.48 | hole 0.35: 21.59,33.02; 6.35,33.02; 6.35,2.54; 21.59,2.54
TEENSY41 = drill 1.016 pad 1.778: P$5V 5.08,-21.59; P$33V -7.62,-22.86; P$33V2 2.54,17.78; P$33V3 7.62,7.62; P$D0 7.62,-25.4; P$D1 7.62,-22.86; P$D2 7.62,-20.32; P$D3 7.62,-17.78; P$D4 7.62,-15.24; P$D5 7.62,-12.7; P$D6 7.62,-10.16; P$D7 7.62,-7.62; P$D8 7.62,-5.08; P$D9 7.62,-2.54; P$D10 7.62,0; P$D11 7.62,2.54; P$D12 7.62,5.08; P$D13 -7.62,5.08; P$D14 -7.62,2.54; P$D15 -7.62,0; P$D16 -7.62,-2.54; P$D17 -7.62,-5.08; P$D18 -7.62,-7.62; P$D19 -7.62,-10.16; P$D20 -7.62,-12.7; P$D21 -7.62,-15.24; P$D22 -7.62,-17.78; P$D23 -7.62,-20.32; P$D24 7.62,10.16; P$D25 7.62,12.7; P$D26 7.62,15.24; P$D27 7.62,17.78; P$D28 7.62,20.32; P$D29 7.62,22.86; P$D30 7.62,25.4; P$D31 7.62,27.94; P$D32 7.62,30.48; P$D33 -7.62,30.48; P$D34 -7.62,27.94; P$D35 -7.62,25.4; P$D36 -7.62,22.86; P$D37 -7.62,20.32; P$D38 -7.62,17.78; P$D39 -7.62,15.24; P$D40 -7.62,12.7; P$D41 -7.62,10.16; P$D+ 5.08,-16.51; P$D- 5.08,-19.05; P$GND2 7.62,-27.94; P$PGM -2.54,17.78; P$RST -5.08,17.78; P$VBAT 5.08,17.78; P$VIN -7.62,-27.94; P$VUSB -5.08,-25.4 | drill 0.889 square: P$D48 2.54,30.48; P$D49 4.445,22.86; P$D50 2.54,27.94; P$D51 2.54,24.13; P$D52 -2.54,26.67; P$D53 -2.54,21.59; P$D54 -2.54,29.21; P$GND7 -3,-13; P$LED -3,-15; P$R+ -5,-15; P$R- -5,-13; P$T+ -1,-13; P$T- -1,-15 | drill 1.016 pad 1.778 square: P$GND1 -7.62,-25.4; P$GND3 -7.62,7.62; P$GND4 0,17.78; P$GND5 5.08,-13.97; P$GND6 5.08,-11.43
SOT323 = smd 0.7 x 0.7: 1 -0.65,-0.925; 2 0.65,-0.925; 3 0,0.925
ESP01 = drill 0.8: CH_PD -1.285,-8.178; GPIO0 1.255,-5.638; GPIO2 -1.285,-5.638; RST 1.255,-8.178; TX -3.825,-8.178; VCC 3.795,-8.178 | drill 0.8 square: GND -3.825,-5.638; RX 3.795,-5.638

### Placement (x,y rotation side)
C1  64.52,138.94 180 top
C2  75.18,146.05 0 top
C3  34.04,150.88 0 top
CLKBAT  86.11,124.46 90 top
H1  9.4,92.2 0 top
H2  97.79,5.08 0 top
H3  93.22,142.24 0 top
H4  93.22,92.2 0 top
H5  5.08,5.08 0 top
H6  97.79,152.4 0 top
H7  5.08,152.4 0 top
H8  9.4,142.24 0 top
IC1  21.08,150.88 180 top
J1  8.89,133.6 270 top
J1-PRTR  99.57,130.56 90 top
J2  48.77,139.7 270 top
J2-PWR  73.91,137.92 0 top
J3  63.25,150.62 270 top
J4  71.37,141.48 0 top
J5  76.45,141.48 0 top
J6  81.79,141.48 0 top
LS2  58.17,121.41 0 bottom
R1  32,142.49 0 top
R2  32,132.33 0 top
R3  49.53,93.98 90 top
R4  53.34,85.09 180 top
R5  64.77,85.09 180 top
R6  32,135.89 0 top
R7  32,139.19 180 top
S1  87.63,152.4 0 top
S2  5.08,46.99 90 top
S3  12.7,46.99 90 top
S4  20.32,46.99 90 top
S5  27.94,46.99 90 top
S6  35.56,46.99 90 top
S7  43.18,46.99 90 top
S8  50.8,46.99 90 top
S9  58.42,46.99 90 top
S10  66.04,46.99 90 top
S11  73.66,46.99 90 top
S12  81.28,46.99 90 top
S13  88.9,46.99 90 top
S14  96.52,46.99 90 top
S15  5.08,36.83 90 top
S16  12.7,36.83 90 top
S17  20.32,36.83 90 top
S18  27.94,36.83 90 top
S19  35.56,36.83 90 top
S20  43.18,36.83 90 top
S21  50.8,36.83 90 top
S22  58.42,36.83 90 top
S23  66.04,36.83 90 top
S24  73.66,36.83 90 top
S25  81.28,36.83 90 top
S26  88.9,36.83 90 top
S27  96.52,36.83 90 top
S28  5.08,26.67 90 top
S29  12.7,26.67 90 top
S30  20.32,26.67 90 top
S31  27.94,26.67 90 top
S32  35.56,26.67 90 top
S33  43.18,26.67 90 top
S34  50.8,26.67 90 top
S35  58.42,26.67 90 top
S36  66.04,26.67 90 top
S37  73.66,26.67 90 top
S38  81.28,26.67 90 top
S39  88.9,26.67 90 top
S40  96.52,26.67 90 top
S41  8.89,16.51 90 top
S42  16.51,16.51 90 top
S43  24.13,16.51 90 top
S44  31.75,16.51 90 top
S45  39.37,16.51 90 top
S46  46.99,16.51 90 top
S47  54.61,16.51 90 top
S48  62.23,16.51 90 top
S49  69.85,16.51 90 top
S50  77.47,16.51 90 top
S51  85.09,16.51 90 top
S52  92.71,16.51 90 top
S53  12.7,6.35 90 top
S54  20.32,6.35 90 top
S55  27.94,6.35 90 top
S56  35.56,6.35 90 top
S57  7.62,60.96 0 top
S58  50.8,6.35 90 top
S59  7.62,72.39 0 top
S60  66.04,6.35 90 top
S61  73.66,6.35 90 top
S62  81.28,6.35 90 top
S63  88.9,6.35 90 top
S64  99.57,104.39 180 top
S65  76.96,153.16 90 top
T1  41.91,133.1 0 top
U$1  99.06,52.07 90 top
U$2  31.75,99.06 180 top
U$3  38.86,143.26 0 top
U$4  81.03,105.16 270 top

### Tracks (layer width: path | path; a pad name or v marks a point on that pad's centre or on a via)
GND  (2 unrouted)
  pour Top (isolate 0.305): 0.25,157.23 102.36,157.23 102.36,0.25 0.25,0.25
  pour Bottom (isolate 0.305): 0.25,157.23 102.36,157.23 102.36,0.25 0.25,0.25
N$1
  Top 0.254: U$2.P$VBAT 26.76,81.38 27.56,81.38 28.7,82.53 34.87,82.53 35.56,81.84 35.56,80.81 38.88,77.5 62.88,77.5 84.71,99.33 84.71,134.87 86.08,136.25 CLKBAT.1
N$2
  Top 0.254: S11.3 76.02,43.78 77.16,43.78 78.42,45.03 82.19,45.03 83.45,43.78 S12.3 83.57,43.66 84.82,42.41 87.11,42.41 88.37,43.66 91.11,43.66 S13.3 91.22,43.78 92.48,45.03 94.77,45.03 96.02,43.78 98.77,43.78 S14.3 | U$2.P$D33 39.33,68.58 39.33,45.26 37.85,43.78 S6.3
  Bottom 0.254: S11.3 75.91,43.78 74.65,45.03 70.88,45.03 69.62,43.78 68.36,43.78 S10.3 68.25,43.66 65.51,43.66 64.25,42.41 61.96,42.41 60.71,43.66 S9.3 60.59,43.78 57.96,43.78 56.71,45.03 54.42,45.03 53.16,43.78 S8.3 53.05,43.78 51.79,45.03 48.02,45.03 46.76,43.78 45.5,43.78 S7.3 45.39,43.66 44.25,43.66 42.53,41.95 39.56,41.95 37.85,43.66 S6.3 37.73,43.66 36.47,42.41 32.7,42.41 31.45,43.66 30.3,43.66 S5.3 30.07,43.78 28.7,42.41 25.16,42.41 23.9,43.66 22.64,43.66 S4.3 22.53,43.66 19.79,43.66 18.53,42.41 16.24,42.41 14.99,43.66 S3.3 14.87,43.66 13.61,42.41 9.96,42.41 8.7,43.66 7.44,43.66 S2.3
N$3
  Top 0.254: S25.3 82.19,32.23 78.54,32.23 77.28,33.49 76.02,33.49 S24.3 | S22.3 59.33,32.23 55.68,32.23 54.42,33.49 53.16,33.49 S21.3 | U$2.P$D34 39.33,71.09 39.33,70.29 38.08,69.04 38.08,64.58 38.88,63.78 38.88,53.15 35.56,49.84 35.56,35.78 37.73,33.6 S19.3
  Bottom 0.254: S25.3 83.57,33.49 84.82,32.23 87.11,32.23 88.37,33.49 91.11,33.49 S26.3 91.22,33.49 92.48,32.23 94.77,32.23 96.02,33.49 98.77,33.49 S27.3 | S22.3 60.71,33.49 61.96,32.23 64.25,32.23 65.51,33.49 68.25,33.49 S23.3 68.36,33.49 69.62,32.23 71.91,32.23 73.16,33.49 75.91,33.49 S24.3 | S15.3 7.44,33.49 8.7,33.49 9.96,32.23 13.61,32.23 S16.3 14.99,33.49 16.24,32.23 18.53,32.23 19.79,33.49 22.53,33.49 S17.3 22.64,33.6 23.9,33.6 25.16,34.86 28.82,34.86 30.07,33.6 S18.3 30.3,33.49 31.56,33.49 32.82,32.23 36.47,32.23 S19.3 37.85,33.49 39.1,32.23 41.39,32.23 42.65,33.49 45.39,33.49 S20.3 45.5,33.49 46.76,32.23 49.05,32.23 50.3,33.49 53.05,33.49 S21.3
N$4
  Top 0.254: U$2.P$D35 39.45,73.61 43.1,73.61 71.68,45.03 71.91,45.03 74.65,42.29 74.65,24.69 S37.3 76.02,23.43 77.28,24.69 79.57,24.69 80.82,23.43 83.45,23.43 S38.3 | S40.3 98.77,23.32 96.02,23.32 94.77,22.06 92.48,22.06 91.22,23.32 S39.3
  Bottom 0.254: S28.3 7.44,23.32 8.7,23.32 9.96,22.06 13.61,22.06 14.87,23.32 S29.3 14.99,23.55 16.13,24.69 18.64,24.69 19.9,23.43 22.53,23.43 S30.3 22.64,23.32 23.9,23.32 25.16,22.06 28.93,22.06 30.19,23.32 S31.3 30.3,23.32 31.56,23.32 32.82,22.06 36.47,22.06 37.73,23.32 S32.3 37.85,23.55 38.99,24.69 41.5,24.69 42.76,23.43 45.39,23.43 S33.3 45.5,23.32 46.76,22.06 49.05,22.06 50.3,23.32 53.05,23.32 S34.3 53.16,23.32 54.42,23.32 55.68,22.06 59.33,22.06 60.59,23.32 S35.3 60.71,23.55 61.85,24.69 64.36,24.69 65.62,23.43 68.25,23.43 S36.3 68.36,23.32 69.62,23.32 70.88,22.06 74.65,22.06 75.91,23.32 S37.3 | S39.3 91.11,23.32 88.37,23.32 87.11,22.06 84.82,22.06 83.57,23.32 S38.3
N$5  (via drill 0.61)
  Top 0.254: S51.3 88.59,13.26 89.97,11.89 93.51,11.89 94.88,13.26 S52.3 | v43.9,64.35 58.88,49.38 58.88,37.26 62.42,33.72 62.42,15.32 64.48,13.26 S48.3
  Bottom 0.254: S41.3 12.36,13.26 13.73,14.63 17.39,14.63 18.76,13.26 S42.3 18.87,13.26 20.24,14.63 22.3,14.63 23.67,13.26 S43.3 26.42,13.37 27.67,14.63 29.96,14.63 31.33,13.26 S44.3 34.07,13.37 35.33,14.63 37.62,14.63 38.88,13.37 41.62,13.37 S45.3 42.88,13.26 44.25,14.63 47.79,14.63 49.16,13.26 S46.3 49.28,13.37 50.53,14.63 52.82,14.63 54.19,13.26 S47.3 56.93,13.37 58.19,13.37 59.45,14.63 63.22,14.63 64.48,13.37 S48.3 64.59,13.26 65.96,14.63 68.02,14.63 69.39,13.26 S49.3 72.14,13.37 73.39,14.63 75.68,14.63 77.05,13.26 S50.3 79.79,13.37 81.05,14.63 83.34,14.63 84.71,13.26 S51.3 | v43.9,64.35 43.9,70.87 39.45,75.32 39.45,76.12 U$2.P$D36
N$6
  Top 0.254: U$2.P$D37 39.45,78.75 39.45,79.55 41.05,81.15 41.05,92.01 40.36,92.7 20.47,92.7 5.73,77.95 5.73,71.44 4.47,70.18 S59.3 4.36,70.07 3.1,68.81 3.1,62.64 4.36,61.38 4.36,58.75 S57.3
  Bottom 0.254: S63.3 91.11,3.09 88.48,3.09 87.22,1.83 84.71,1.83 83.57,2.97 S62.3 83.45,3.2 82.19,4.46 78.54,4.46 77.28,3.2 76.02,3.2 S61.3 75.91,3.2 74.65,4.46 70.88,4.46 69.62,3.2 68.36,3.2 S60.3 68.25,3.2 66.99,4.46 63.34,4.46 62.08,3.2 53.16,3.2 S58.3 51.79,1.83 47.9,1.83 46.76,2.97 37.85,2.97 S56.3 37.73,3.2 36.47,4.46 32.82,4.46 31.56,3.2 30.3,3.2 S55.3 30.19,3.2 28.93,4.46 25.16,4.46 23.9,3.2 22.64,3.2 S54.3 22.53,3.2 21.27,4.46 17.61,4.46 16.36,3.2 14.99,3.2 S53.3 14.87,3.2 4.47,13.6 4.47,58.64 S57.3
N$7
  Top 0.254: S53.1 10.41,3.2 10.41,7.77 6.64,11.54 6.64,13.14 S41.1 6.53,13.26 6.53,18.06 2.87,21.72 2.87,23.32 S28.1 2.87,23.43 2.87,28.12 4.13,29.38 4.13,32.23 2.87,33.49 S15.1 2.87,33.6 2.87,38.29 4.13,39.55 4.13,42.41 2.87,43.66 S2.1 2.87,43.78 2.87,47.66 12.24,57.04 12.24,71.21 23.56,82.53 24.59,82.53 30.87,88.81 39.33,88.81 U$2.P$D41
N$8  (via drill 0.61)
  Top 0.254: S55.1 25.62,3.2 25.62,7.77 23.9,9.49 23.9,11.32 21.96,13.26 S43.1 21.84,13.37 21.84,17.95 20.13,19.66 20.13,21.26 18.07,23.32 S30.1 18.07,23.43 18.07,28.12 19.33,29.38 19.33,32.23 18.07,33.49 S17.1 18.07,33.6 18.07,38.29 19.33,39.55 19.33,42.41 18.07,43.66 S4.1 18.07,43.78 18.07,47.55 25.39,54.86 v25.39,61.27
  Bottom 0.254: U$2.P$D3 24.13,116.13 22.87,114.87 22.87,108.7 23.67,107.9 24.7,107.9 25.39,107.21 25.39,98.53 24.7,97.84 23.67,97.84 22.87,97.04 22.87,85.84 23.67,85.04 24.7,85.04 25.39,84.35 v25.39,61.27
N$9
  Top 0.254: S54.1 17.96,3.2 17.96,7.89 16.24,9.6 16.24,11.32 14.3,13.26 S42.1 14.19,13.37 14.19,17.95 12.47,19.66 12.47,21.37 10.53,23.32 S29.1 10.53,23.43 10.53,28.12 11.79,29.38 11.79,32.23 S16.1 10.53,33.6 10.53,38.29 11.79,39.55 11.79,42.41 10.53,43.66 S3.1 10.53,43.78 12.7,45.95 12.7,69.04 23.67,80.01 24.59,80.01 25.39,80.81 25.39,81.72 29.96,86.3 39.33,86.3 U$2.P$D40
N$10  (via drill 0.61)
  Top 0.254: v41.28,101.27 41.85,101.27 77.16,136.59 79.57,136.59 83.11,140.13 83.11,153.39 S1.1
  Bottom 0.254: v41.28,101.27 41.28,83.9 39.45,82.07 39.45,81.38 U$2.P$D38
N$11  (via drill 0.61)
  Top 0.254: S56.1 33.27,3.2 33.27,7.77 31.56,9.49 31.56,11.09 29.5,13.14 S44.1 29.39,13.26 29.39,18.06 27.67,19.77 27.67,21.37 25.73,23.32 S31.1 25.73,23.43 25.73,28.12 26.99,29.38 26.99,32.23 25.73,33.49 S18.1 25.73,33.6 25.73,38.29 26.99,39.55 26.99,42.41 25.73,43.66 S5.1 | U$2.P$D4 24.13,113.5 3.1,92.47 v3.1,71.32
  Bottom 0.254: v3.1,71.32 3.1,62.64 14.19,51.55 15.56,51.55 16.7,50.41 16.7,49.72 21.39,45.03 24.36,45.03 25.62,43.78 S5.1
N$12
  Top 0.254: U$2.P$D- 26.76,118.19 26.76,118.99 27.9,120.13 27.9,130.76 26.87,131.79 26.87,132.82 27.67,133.62 32.7,133.62 35.33,130.99 42.65,130.99 47.56,135.9 47.56,137.27 J2.D-
N$13
  Top 0.254: S6.1 33.27,43.66 33.27,41.95 32.02,40.69 32.02,34.86 S19.1 34.65,32.23 34.65,29.38 33.39,28.12 33.39,23.43 S32.1 33.39,23.32 35.33,21.37 35.33,19.66 37.05,17.95 37.05,13.26 S45.1 | S57.1 6.19,65.04 6.19,77.72 17.27,88.81 24.13,88.81 U$2.P$D24
  Bottom 0.254: S6.1 33.27,43.78 32.02,43.78 26.87,48.92 21.27,48.92 12.81,57.38 10.3,57.38 4.47,63.21 S57.1
N$14
  Top 0.254: IC1.2 21.04,154.65 21.04,145.73 8.93,133.62 J1.1 8.81,133.5 7.56,132.25 7.56,117.84 8.81,116.59 8.81,115.9 J1.8
  Bottom 0.254: R3.P$2 49.51,97.73 49.51,92.01 48.25,90.75 48.25,86.64 49.62,85.27 R4.P$2 49.62,85.15 55.33,85.15 56.59,86.41 59.68,86.41 60.94,85.15 R5.P$2 61.05,85.15 66.76,85.15 83.91,102.3 97.4,102.3 99.45,104.36 S64.2 99.57,104.47 100.94,105.84 100.94,136.13 99.45,137.62 83.8,137.62 76.48,144.93 76.48,145.96 C2.2 76.36,146.07 74.99,147.45 47.9,147.45 41.62,141.16 34.65,141.16 21.16,154.65 IC1.2
N$15
  Top 0.254: S58.1 48.48,3.2 48.48,7.77 44.82,11.43 44.82,13.26 S46.1 44.7,13.37 44.7,17.95 42.99,19.66 42.99,21.26 40.93,23.32 S33.1 40.93,23.43 40.93,28.12 42.19,29.38 42.19,32.23 40.93,33.49 S20.1 40.93,33.6 40.93,38.29 42.19,39.55 42.19,42.41 40.93,43.66 S7.1
  Bottom 0.254: U$2.P$D25 24.13,86.3 27.9,82.53 27.9,80.81 36.47,72.24 36.47,49.61 40.82,45.26 40.82,43.78 S7.1
N$16
  Top 0.254: U$2.P$D0 24.13,124.47 12.93,124.47 8.93,128.47 J1.3
N$17  (via drill 0.61)
  Top 0.254: S47.1 52.25,13.26 52.25,18.06 50.53,19.77 50.53,21.37 48.59,23.32 S34.1 48.59,23.43 48.59,28.12 49.85,29.38 49.85,32.23 48.59,33.49 S21.1 48.59,33.6 49.85,34.86 49.85,40.58 48.59,41.83 48.59,43.66 S8.1 48.48,43.78 47.22,43.78 45.96,45.03 40.36,45.03 39.1,43.78 39.1,43.2 38.3,42.41 37.28,42.41 36.47,43.2 v36.47,45.26 | v14.76,85.04 24.59,85.04 29.73,90.18 39.9,90.18 40.59,89.5 40.59,85.84 39.45,84.7 39.45,83.9 U$2.P$D39
  Bottom 0.254: S59.1 6.36,76.64 | 6.36,76.64 v14.76,85.04 | v36.47,45.26 31.56,50.18 31.56,51.44 6.36,76.64
N$18
  Bottom 0.254: U$2.P$D8 24.13,104.93 14.07,114.99 14.07,120.81 8.93,125.96 J1.4
N$19  (via drill 0.61)
  Top 0.254: S60.1 63.68,3.2 63.68,7.89 60.02,11.54 60.02,13.26 S48.1 59.91,13.37 59.91,17.95 58.19,19.66 58.19,21.37 56.25,23.32 S35.1 | v41.05,109.16 v41.05,112.13 | v40.25,64.35 40.25,60.35 56.13,44.46 56.13,43.78 S9.1 56.25,43.66 57.51,42.41 57.51,39.55 56.25,38.29 56.25,33.6 S22.1
  Bottom 0.254: S22.1 57.51,32.23 57.51,29.38 56.25,28.12 56.25,23.43 S35.1 | v41.05,112.13 41.05,116.93 39.45,118.53 39.45,119.33 U$2.P$D23 | v41.05,109.16 39.79,107.9 38.76,107.9 35.56,104.7 35.56,73.84 38.08,71.32 38.08,66.52 v40.25,64.35
N$20
  Bottom 0.254: U$2.P$D9 24.13,102.41 13.61,112.93 13.61,118.76 8.93,123.44 J1.5
N$21
  Top 0.254: S61.1 71.34,3.2 71.34,7.77 69.62,9.49 69.62,11.32 67.68,13.26 S49.1 67.56,13.37 67.56,17.95 65.85,19.66 65.85,21.26 63.79,23.32 S36.1 63.79,23.43 63.79,28.12 65.05,29.38 65.05,32.23 63.79,33.49 S23.1 63.79,33.6 63.79,38.29 65.05,39.55 65.05,42.41 63.79,43.66 S10.1 63.68,43.78 59.33,48.12 59.33,52.92 39.9,72.35 37.39,72.35 31.1,78.64 24.13,78.64 U$2.P$D28
N$22
  Bottom 0.254: U$2.P$D26 24.13,83.9 13.16,94.87 13.16,116.59 8.93,120.81 J1.6
N$23  (via drill 0.61)
  Top 0.254: S62.1 78.99,3.2 78.99,7.77 77.28,9.49 77.28,11.09 75.22,13.14 S50.1 75.11,13.26 75.11,18.06 73.39,19.77 73.39,21.37 71.45,23.32 S37.1 71.45,23.43 71.45,28.12 72.71,29.38 72.71,32.23 71.45,33.49 S24.1 71.45,33.6 71.45,38.29 72.71,39.55 72.71,42.41 71.45,43.66 S11.1 71.34,43.78 68.71,46.41 v62.65,46.41 | v37.96,63.44 33.16,68.24 33.16,69.15 30.07,72.24 29.27,72.24 25.39,76.12 24.13,76.12 U$2.P$D29
  Bottom 0.254: v37.96,63.44 45.62,63.44 v62.65,46.41
N$24
  Bottom 0.254: U$2.P$D27 24.13,82.07 12.7,93.5 12.7,114.53 8.93,118.3 J1.7
N$25  (via drill 0.61)
  Top 0.254: S63.1 86.54,3.2 86.54,7.89 84.82,9.6 84.82,11.32 82.88,13.26 S51.1 82.77,13.37 82.77,17.95 81.05,19.66 81.05,21.37 79.11,23.32 S38.1 | U$2.P$D30 24.13,72.92 22.87,71.67 22.87,65.04 31.9,56.01 v31.9,41.95 | S25.1 79.11,33.6 79.11,38.29 80.37,39.55 80.37,42.41 79.11,43.66 S12.1
  Bottom 0.254: S25.1 80.37,32.23 80.37,29.38 79.11,28.12 79.11,23.43 S38.1 | v31.9,41.95 38.88,41.95 39.33,41.49 76.82,41.49 78.99,43.66 S12.1
N$26  (via drill 0.61)
  Top 0.254: U$2.P$D31 24.13,70.41 34.65,59.89 v34.65,38.98 | S26.1 86.65,33.49 87.91,32.23 87.91,29.38 86.65,28.12 86.65,23.43 S39.1 86.65,23.32 88.71,21.26 88.71,19.66 90.42,17.95 90.42,13.26 S52.1
  Bottom 0.254: v34.65,38.98 37.05,38.98 41.16,34.86 85.28,34.86 | 85.28,34.86 86.54,33.6 S26.1 | 85.28,34.86 85.28,40.58 86.54,41.83 86.54,43.66 S13.1
N$27
  Top 0.254: S40.1 94.31,23.43 94.31,28.12 95.57,29.38 95.57,32.23 94.31,33.49 S27.1 94.31,33.6 94.31,38.29 95.57,39.55 95.57,42.41 94.31,43.66 S14.1
  Bottom 0.254: U$2.P$D32 24.13,61.27 39.56,45.83 39.56,43.2 40.36,42.41 42.3,42.41 45.39,45.49 92.48,45.49 94.2,43.78 S14.1
N$28
  Top 0.254: U$2.P$D1 24.13,121.84 17.39,121.84 8.93,113.39 J1.9
N$29
  Bottom 0.254: U$1.UD 91.34,54.63 78.08,54.63 42.19,90.53 42.19,101.61 39.68,104.13 39.45,104.13 U$2.P$D17
N$30
  Top 0.254: U$2.P$D+ 26.76,115.56 37.28,115.56 38.08,114.76 38.08,113.84 38.88,113.04 39.9,113.04 49.85,122.99 49.85,137.27 J2.D+
N$31
  Top 0.254: J3.2 58.19,145.73 40.13,145.73 33.85,152.02 31.1,152.02 25.39,146.3 25.39,115.1 26.19,114.3 27.67,114.3 27.9,114.07 27.9,102.87 24.13,99.1 U$2.P$D10
N$32
  Bottom 0.254: U$4.VCC 72.94,101.38 73.51,101.38 74.88,102.76 95.45,102.76 99.57,106.87 S64.3
N$33
  Top 0.254: J3.3 68.13,145.62 68.13,134.99 41.05,107.9 37.96,107.9 24.13,94.07 U$2.P$D12
N$34
  Bottom 0.254: U$4.GPIO0 75.34,103.9 74.42,103.9 72.94,102.41 61.85,102.41 49.62,90.18 R3.P$1
N$35
  Top 0.254: U$4.CH_PD 72.82,106.41 72.82,105.39 57.16,89.72 57.16,85.15 R4.P$1
N$36
  Top 0.254: U$4.RST 72.82,103.9 72.82,102.87 68.59,98.64 68.59,85.15 R5.P$1
N$37
  Top 0.254: U$4.RX 75.34,101.38 75.34,102.41 73.96,103.78 73.96,106.87 73.28,107.56 50.42,107.56 39.45,96.58 U$2.P$D14
N$38
  Top 0.254: U$4.TX 72.82,108.93 50.19,108.93 40.36,99.1 39.45,99.1 U$2.P$D15
N$39
  Bottom 0.254: J3.10 60.82,145.62 60.82,142.88 64.71,138.99 64.71,122.53 65.73,121.5 LS2.+
N$40
  Top 0.254: U$3.2 39.56,142.42 39.56,144.7 39.33,144.93 38.3,144.93 35.9,142.53 R1.P$2 | J2-PWR.3 78.99,138.65 81.74,141.39 J6.1
  Bottom 0.254: R1.P$2 35.9,142.53 42.3,142.53 47.68,147.9 76.14,147.9 77.85,146.19 77.85,145.39 81.74,141.5 J6.1
N$41
  Top 0.254: 40.19,138.25 43.1,135.33 43.1,133.16 T1.1 | 40.19,138.25 38.3,140.13 38.3,142.3 U$3.1 | 40.19,138.25 36.47,134.53 35.33,134.53 28.25,141.62 28.25,142.42 R1.P$1
N$42
  Bottom 0.254: U$1.LR 71.11,54.63 70.54,54.63 68.13,57.04 62.88,57.04 39.9,80.01 38.88,80.01 38.08,80.81 38.08,100.24 39.33,101.5 U$2.P$D16
N$43
  Bottom 0.254: U$2.P$D18 39.45,106.76 69.05,106.76 92.82,130.53 99.57,130.53 J1-PRTR.1
N$44
  Bottom 0.254: U$2.P$D19 39.45,109.27 39.9,109.27 40.93,110.3 71.91,110.3 94.65,133.04 99.57,133.04 J1-PRTR.2
N$45
  Top 0.254: T1.2 41.85,134.99 38.53,134.99 35.9,132.36 R2.P$2
N$46
  Top 0.254: J2-PWR.1 73.85,137.96 73.85,138.99 71.45,141.39 J4.1 71.45,141.5 71.45,145.16 76.94,150.65 76.94,153.16 S65.2
N$47
  Top 0.254: 68.59,74.98 68.59,77.38 U$1.UDV+ | 68.59,74.98 68.59,54.63 U$1.LRV+ | 68.59,74.98 38.76,74.98 33.73,80.01 30.53,80.01 29.27,81.27 U$2.P$33V2
  Bottom 0.254: U$2.P$33V2 29.16,81.38 29.16,85.61 24.13,90.64 U$2.P$33V3 24.13,91.55 25.39,92.81 25.39,97.04 38.88,110.53 39.9,110.53 40.13,110.76 40.93,110.76 41.96,111.78 41.96,118.53 39.45,121.04 39.45,121.84 U$2.P$33V
N$48
  Top 0.254: R7.P$2 28.25,139.1 28.25,135.9 R6.P$1
  Bottom 0.254: U$2.P$D20 39.33,111.78 39.33,112.58 38.08,113.84 38.08,125.96 28.25,135.79 R6.P$1
N$49
  Top 0.254: U$3.3 38.76,144.13 37.16,142.53 37.16,137.16 35.9,135.9 R6.P$2
N$50
  Top 0.254: U$2.P$D21 39.33,114.3 39.33,115.1 28.36,126.07 28.36,132.13 28.25,132.25 R2.P$1
N$51
  Top 0.356: J2.VBUS 45.16,137.39 42.42,137.39 40.93,138.88 40.93,144.13 34.19,150.88 C3.1 31.45,150.76 26.3,145.62 26.3,131.56 26.64,131.22 26.64,120.7 U$2.P$5V
VCC
  Top 0.356: C1.2 63.34,138.99 63.34,143.1 73.05,152.82 73.05,153.73 73.85,154.53 78.08,154.53 79.45,153.16 S65.3
  Bottom 0.356: IC1.3 18.64,154.65 18.64,153.96 34.42,138.19 34.42,131.79 39.1,127.1 39.33,127.1 U$2.P$VIN 39.45,127.22 50.53,127.22 62.19,138.88 63.22,138.88 C1.2
(copper drawn outside any net)
  shapes: Top area x6

### Text on the board
tPlace: Reset | WiFi / Power | RA | LA | jorj@jorj.org | AiiE! 20200731 | 1! | 2@ | 3# | 4$ | 5% | 6^ | 7& | 8* | 9( | 0) | -_ | =+ | DEL | ESC | Q | W | E | R | T | Y | U | I | O | P | [{ | ]} | CTRL | A | S | D | F | G | H | J | K | L | ;: | '" | RET | SHFT | Z | X | C | V | B | N | M | ,< | .> | /? | SHFT | LOCK | `~ | TAB | \\| | SPACE | left | right | down | up
bPlace: +5 | G | +B | + | Backup / Battery | - | + | Speaker | -